# Altium schematic sheet `schemetic phongbep.SchDoc
size A; SheetNumber: 1; SheetTotal: 1
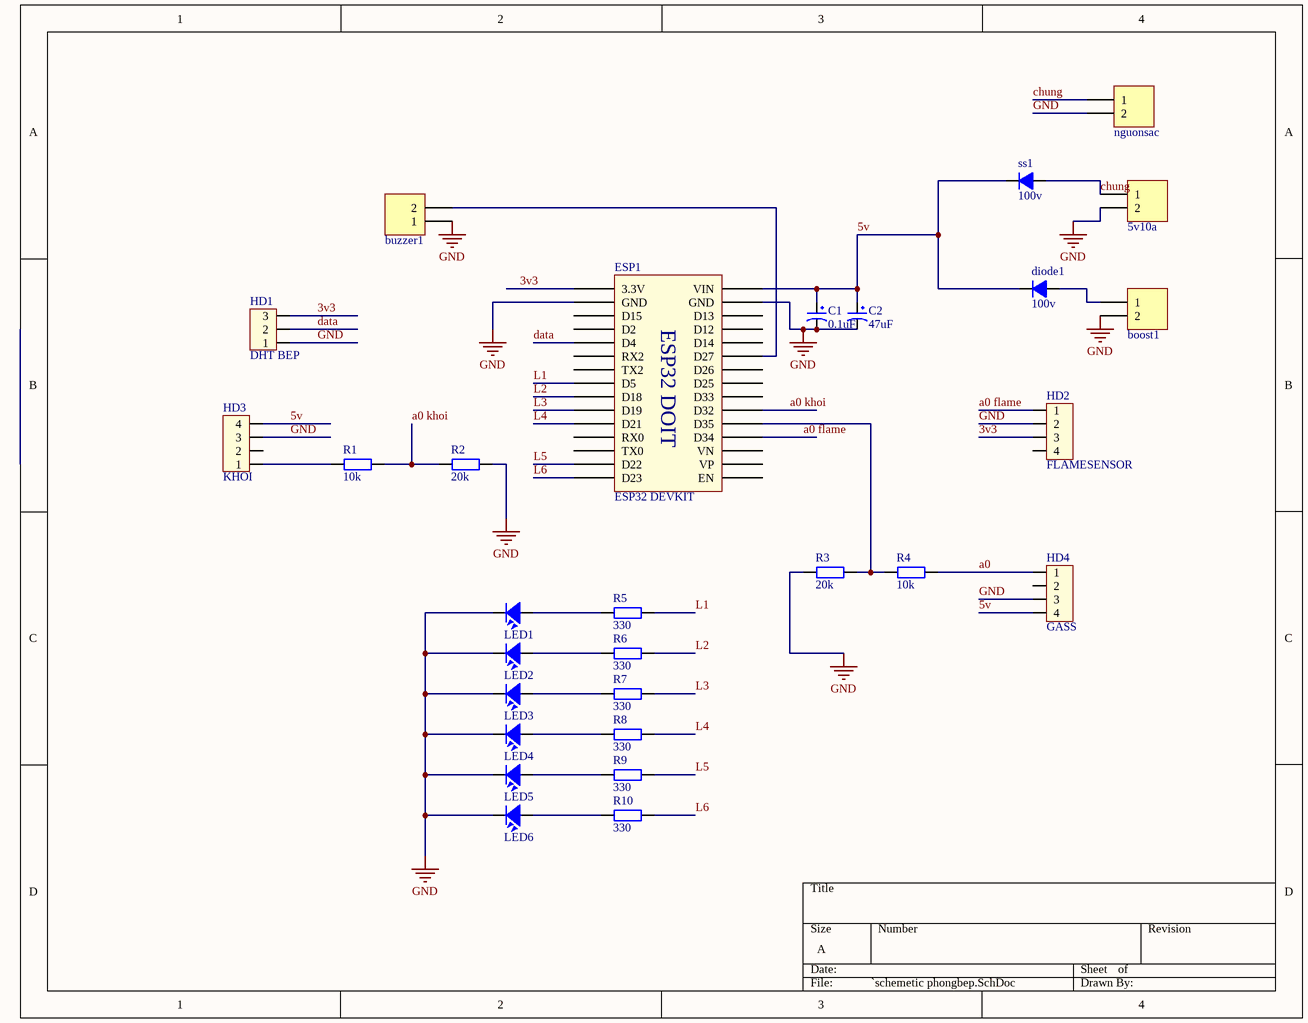
[diagram p0: `schemetic phongbep.SchDoc]

## Parts
5v10a  Header 2_1  [HED2]  (value not drawn)
boost1  Header 2_1  [HED2]  (value not drawn)
buzzer1  Header 2_1  [HED2]  (value not drawn)
C1  0.1uF  [tu hoa 5mm]
C2  47uF  [tu hoa 5mm]
diode1  100v  [DIODE 0.5A]
ESP1  ESP32 DEVKIT  [ESP32 WROOM 32 KIT]
HD1  DHT BEP  [HED3]
HD2  FLAMESENSOR  [HED4]
HD3  KHOI  [HED4]
HD4  GASS  [HED4]
LED1  LED  [LED-5-Green]  (value not drawn)
LED2  LED  [LED-5-Green]  (value not drawn)
LED3  LED  [LED-5-Green]  (value not drawn)
LED4  LED  [LED-5-Green]  (value not drawn)
LED5  LED  [LED-5-Green]  (value not drawn)
LED6  LED  [LED-5-Green]  (value not drawn)
nguonsac  Header 2_1  [HED2]  (value not drawn)
R1  10k  [R1/4W]
R2  20k  [R1/4W]
R3  20k  [R1/4W]
R4  10k  [R1/4W]
R5  330  [R1/4W]
R6  330  [R1/4W]
R7  330  [R1/4W]
R8  330  [R1/4W]
R9  330  [R1/4W]
R10  330  [R1/4W]
ss1  100v  [DIODE 0.5A]

## Nets
GND: 5v10a.2 boost1.2 buzzer1.1 C1.2 C2.2 ESP1.14(GND) ESP1.17(GND) HD1.1 HD2.2 HD3.3 HD4.3 LED1.2 LED2.2 LED3.2 LED4.2 LED5.2 LED6.2 nguonsac.2 R2.1 R3.2
3v3: ESP1.16(3.3V) HD1.3 HD2.3
5v: C1.1 C2.1 diode1.2(K) ESP1.15(VIN) HD3.4 HD4.4 ss1.2(K)
a0: HD4.1 R4.2
a0 flame: ESP1.4(D34) HD2.1
a0 khoi: ESP1.6(D32) R1.2 R2.2
chung: 5v10a.1 nguonsac.1 ss1.1(A)
data: ESP1.20(D4) HD1.2
L1: ESP1.23(D5) R5.2
L2: ESP1.24(D18) R6.2
L3: ESP1.25(D19) R7.2
L4: ESP1.26(D21) R8.2
L5: ESP1.29(D22) R9.2
L6: ESP1.30(D23) R10.2
Netboost1_1: boost1.1 diode1.1(A)
Netbuzzer1_2: buzzer1.2 ESP1.10(D27)
NetESP1_5: ESP1.5(D35) R3.1 R4.1
NetHD3_1: HD3.1 R1.1
NetLED1_1: LED1.1 R5.1
NetLED2_1: LED2.1 R6.1
NetLED3_1: LED3.1 R7.1
NetLED4_1: LED4.1 R8.1
NetLED5_1: LED5.1 R9.1
NetLED6_1: LED6.1 R10.1

Not connected (* = marked no-connect by the designer): ESP1 1(EN) 2(VP) 3(VN) 7(D33) 8(D25) 9(D26) 11(D14) 12(D12) 13(D13) 18(D15) 19(D2) 21(RX2) 22(TX2) 27(RX0) 28(TX0); HD2 4; HD3 2; HD4 2

## Notes on the sheet
- (in symbol ESP32 WROOM 32 KIT) ESP32 DOIT

## Library data of the parts
5v10a boost1 buzzer1 nguonsac = Header 2_1: Header, 2-Pin; Manufacturer: Generic Components; Class: Connector; Value: Header 2
C1 = Tu Hoa 0.1uF 50V 5x11: Cắm; Don_Vi: Con; So_Chan: 2; Ten_Linh_Kien: Tụ Hóa 0.1uF 50V; Ma_Hang: MH006853; Chung_Loai: Cắm; Kieu_Chan: *
C2 = Tu Hoa 47uF 16V 5x10: Cắm; Don_Vi: Con; So_Chan: 2; Ten_Linh_Kien: Tụ Hóa 47uF 16V; Ma_Hang: MH006859; Chung_Loai: Cắm; Kieu_Chan: *
diode1 ss1 = Diode 1N4148: Cắm; Ten_Linh_Kien: Diode 1N4148 DO35 450mA 100V ( 1N4148 DIP); Don_Vi: Con; Ma_Hang: MH001065; Ghi Chu: *; Kieu_Chan: *; Chung_Loai: Cắm
ESP1 = ESP32 WROOM 32 KIT
HD1 = Hed3: Header 3 (Green); Value: Header 3
HD2-HD4 = Hed4: Header 4 (Green); Value: Header 4
LED1-LED6 = LED: LED Single colour Green and Red; Value: LED 3 ly Single Colour
R1-R10 = R1/4W: Resistor 1/4W; Value: R1/4W - 1K